# Altium schematic sheet Ind_current_sensor_U.SchDoc
size Letter
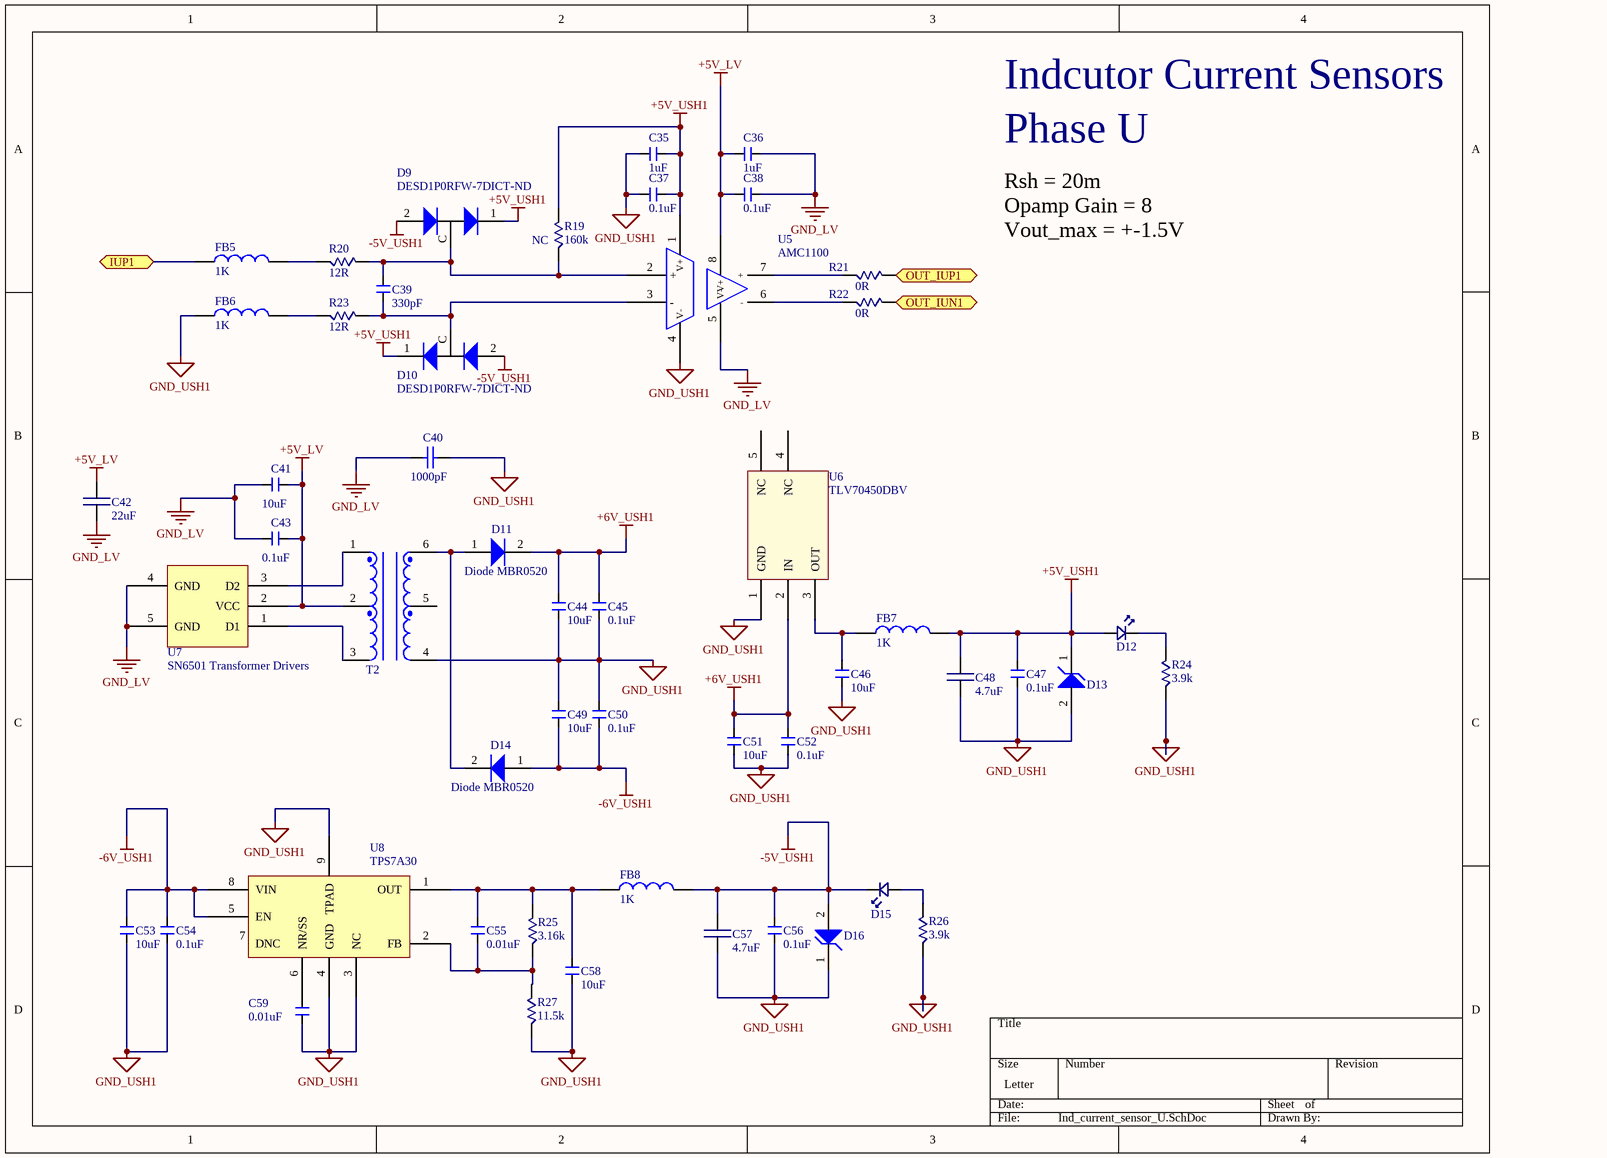
[diagram p0: Ind_current_sensor_U.SchDoc]

## Parts
C35  value 1uF  [0603 (1608 Metric)]  (hidden comment: Cap 0603_new)
C36  value 1uF  [0603 (1608 Metric)]  (hidden comment: Cap 0603_new)
C37  value 0.1uF  [0603 (1608 Metric)]  (hidden comment: Cap 0603_new)
C38  value 0.1uF  [0603 (1608 Metric)]  (hidden comment: Cap 0603_new)
C39  value 330pF  [0603 (1608 Metric)]  (hidden comment: Cap 0603_new)
C40  value 1000pF  [RAD-0.3]  (hidden comment: Cap TH)
C41  value 10uF  [0603 (1608 Metric)]  (hidden comment: Cap 0603_new)
C42  value 22uF  [0805 (2012 metric)]  (hidden comment: Cap 0805)
C43  value 0.1uF  [0603 (1608 Metric)]  (hidden comment: Cap 0603_new)
C44  value 10uF  [0603 (1608 Metric)]  (hidden comment: Cap 0603_new)
C45  value 0.1uF  [0603 (1608 Metric)]  (hidden comment: Cap 0603_new)
C46  value 10uF  [0603 (1608 Metric)]  (hidden comment: Cap 0603_new)
C47  value 0.1uF  [0603 (1608 Metric)]  (hidden comment: Cap 0603_new)
C48  value 4.7uF  [0805 (2012 metric)]  (hidden comment: Cap 0805)
C49  value 10uF  [0603 (1608 Metric)]  (hidden comment: Cap 0603_new)
C50  value 0.1uF  [0603 (1608 Metric)]  (hidden comment: Cap 0603_new)
C51  value 10uF  [0603 (1608 Metric)]  (hidden comment: Cap 0603_new)
C52  value 0.1uF  [0603 (1608 Metric)]  (hidden comment: Cap 0603_new)
C53  value 10uF  [0603 (1608 Metric)]  (hidden comment: Cap 0603_new)
C54  value 0.1uF  [0603 (1608 Metric)]  (hidden comment: Cap 0603_new)
C55  value 0.01uF  [0603 (1608 Metric)]  (hidden comment: Cap 0603_new)
C56  value 0.1uF  [0603 (1608 Metric)]  (hidden comment: Cap 0603_new)
C57  value 4.7uF  [0805 (2012 metric)]  (hidden comment: Cap 0805)
C58  value 10uF  [0603 (1608 Metric)]  (hidden comment: Cap 0603_new)
C59  value 0.01uF  [0603 (1608 Metric)]  (hidden comment: Cap 0603_new)
D9  Part: DESD1P0RFW-7DICT-ND  [SOT323_ESD]  (hidden comment: TVS - Diodes)
D10  Part: DESD1P0RFW-7DICT-ND  [SOT323_ESD]  (hidden comment: TVS - Diodes)
D11  Diode MBR0520  [SOD-123]
D12  LED  [0805 (2012 Metric) Diode]  (value not drawn)
D13  *  [POWERDI]  (value not drawn)
D14  Diode MBR0520  [SOD-123]
D15  LED  [0805 (2012 Metric) Diode]  (value not drawn)
D16  *  [POWERDI]  (value not drawn)
FB5  value 1K  [0603 (1608 Metric)]  (hidden comment: Ferrite bead)
FB6  value 1K  [0603 (1608 Metric)]  (hidden comment: Ferrite bead)
FB7  value 1K  [0603 (1608 Metric)]  (hidden comment: Ferrite bead)
FB8  value 1K  [0603 (1608 Metric)]  (hidden comment: Ferrite bead)
R19  NC  value 160k  [0603 (1608 Metric)]
R20  value 12R  [1206]  (hidden comment: Resistor 1206)
R21  value 0R  [0603 (1608 Metric)]  (hidden comment: Resistor 0603)
R22  value 0R  [0603 (1608 Metric)]  (hidden comment: Resistor 0603)
R23  value 12R  [1206]  (hidden comment: Resistor 1206)
R24  value 3.9k  [0603 (1608 Metric)]  (hidden comment: Resistor 0603)
R25  value 3.16k  [0603 (1608 Metric)]  (hidden comment: Resistor 0603)
R26  value 3.9k  [0603 (1608 Metric)]  (hidden comment: Resistor 0603)
R27  value 11.5k  [0603 (1608 Metric)]  (hidden comment: Resistor 0603)
T2  750313769  [Xmr SN6501]  (value not drawn)
U5  AMC1100  [SOIC8]
U6  TLV70450DBV  [SOT23-5]
U7  SN6501 Transformer Drivers  [SOT23-5]
U8  TPS7A30  [8-TSSOP]

## Ports
IUP1, OUT_IUN1, OUT_IUP1

## Nets
+5V_LV: C36.1(OUT) C38.1(OUT) C41.2(OUT) C42.2(OUT) C43.2(OUT) T2.2 U5.8(V+) U7.2(VCC)
+5V_USH1: C35.2(OUT) C37.2(OUT) C47.2(OUT) C48.2(OUT) D9.1(Anode) D10.1(Anode) D12.A D13.1(Anode) FB7.2(OUT) R19.2(A) U5.1(V+)
+6V_USH1: C44.2(OUT) C45.2(OUT) C51.2(OUT) C52.2(OUT) D11.2(Anode) U6.2(IN)
-5V_USH1: C56.2(OUT) C57.2(OUT) D9.2(Anode) D10.2(Anode) D15.K D16.2(Anode) FB8.2(OUT)
-6V_USH1: C49.1(OUT) C50.1(OUT) C53.2(OUT) C54.2(OUT) D14.1(Anode) U8.5(EN) U8.8(VIN)
GND_LV: C36.2(OUT) C38.2(OUT) C40.1 C41.1(OUT) C42.1(OUT) C43.1(OUT) U5.5(V-) U7.4(GND) U7.5(GND)
GND_USH1: C35.1(OUT) C37.1(OUT) C40.2 C44.1(OUT) C45.1(OUT) C46.1(OUT) C47.1(OUT) C48.1(OUT) C49.2(OUT) C50.2(OUT) C51.1(OUT) C52.1(OUT) C53.1(OUT) C54.1(OUT) C56.1(OUT) C57.1(OUT) C58.1(OUT) C59.1(OUT) D13.2(Anode) D16.1(Anode) FB6.1(OUT) R24.1(A) R26.1(A) R27.1(A) T2.4 U5.4(V-) U6.1(GND) U8.3(NC) U8.4(GND) U8.9(TPAD)
IUP1: FB5.1(OUT) ; port IUP1
OUT_IUN1: R22.2(A) ; port OUT_IUN1
OUT_IUP1: R21.2(A) ; port OUT_IUP1
NetC39_1: C39.1(OUT) D9.C(Cathode) R19.1(A) R20.2(A) U5.2(+)
NetC39_2: C39.2(OUT) D10.C(Cathode) R23.2(A) U5.3(-)
NetC46_2: C46.2(OUT) FB7.1(OUT) U6.3(OUT)
NetC55_1: C55.1(OUT) C58.2(OUT) FB8.1(OUT) R25.2(A) U8.1(OUT)
NetC55_2: C55.2(OUT) R25.1(A) R27.2(A) U8.2(FB)
NetC59_2: C59.2(OUT) U8.6(NR/SS)
NetD11_1: D11.1(Anode) D14.2(Anode) T2.6
NetD12_K: D12.K R24.2(A)
NetD15_A: D15.A R26.2(A)
NetFB5_2: FB5.2(OUT) R20.1(A)
NetFB6_2: FB6.2(OUT) R23.1(A)
NetR21_1: R21.1(A) U5.7(+)
NetR22_1: R22.1(A) U5.6(-)
NetT2_1: T2.1 U7.3(D2)
NetT2_3: T2.3 U7.1(D1)

Not connected (* = marked no-connect by the designer): T2 5(1); U6 4(NC) 5(NC); U8 7(DNC)

## Notes on the sheet
- Indcutor Current Sensors
- Phase U
- Rsh = 20m
  Opamp Gain = 8
  Vout_max = +-1.5V
  Maximum current = +- 9.375A

## Library data of the parts
C35 C36 = Cap 0603_new: CAP CER 1UF 50V X5R 0603; part: 1276-1860-1-ND
C37 C38 C43 C45 C47 C50 C52 C54 C56 = Cap 0603_new: CAP CER 0.1UF 50V Y5V 0603; part: 311-1343-6-ND
C39 = Cap 0603_new: CAP CER 330PF 50V C0G 0603; part: 445-7033-2-ND
C40 = Cap: CAP CER 1000PF 1KV Y5P RADIAL; Part: 1251PH-ND; Published: 8-Jun-2000; LatestRevisionDate: 17-Jul-2002; LatestRevisionNote: Re-released for DXP Platform.; PackageReference: RAD-0.3; Publisher: Altium Limited; PackageDescription: Radial Cap, Thru-Hole; 2 Leads; 0.3 in Pin Spacing
C41 C44 C46 C49 C51 C53 C58 = Cap 0603_new: CAP CER 10UF 35V X5R 0805; part: 490-10515-1-ND
C42 = Cap 0805: CAP CER 22UF 35V X5R 0805; Part: 445-14428-1-ND
C48 C57 = Cap 0805: CAP CER 4.7UF 50V X5R 0805; Part: 445-5980-1-ND
C55 C59 = Cap 0603_new: CAP CER 10000PF 100V X7R 0603; part: 478-7418-1-ND
D9 D10 = Diode_ESD: TVS DIODE 70VWM 8VC SOT323; Value: ESD
D11 D14 = Diode MBR0520: DIODE SCHOTTKY 20V 500MA SOD123; Part: MBR0520LT1GOSCT-ND; Value: *
D12 D15 = LED: LED 0805
D13 D16 = Diode Zener POWERDI123: Part: MMSZ5228B-FDICT-ND; Value: *
FB5-FB8 = Ferrite bead: FERRITE BEAD 1 KOHM 0603 1LN; Part: 445-8672-1-ND
R19 = Resistor 0603
R20 R23 = Resistor 1206: 12 Ohm ±0.5% 0.25W, 1/4W Chip Resistor 1206; Part: 311-2961-1-ND
R21 R22 = Resistor 0603: RES SMD 10 OHM 0.05% 1/10W 0603; Part: RNCF0603AKT10R0CT-ND
R24 R26 = Resistor 0603: RES SMD 3.9K OHM 5% 1/10W 0603; Part: 541-3.9KGCT-ND
R25 = Resistor 0603: RES SMD 3.16K OHM 1% 1/10W 0603; Part: 311-3.16KHRCT-ND
R27 = Resistor 0603: RES SMD 11.5K OHM 1% 1/10W 0603; Part: 541-11.5KHCT-ND
T2 = 750313769: TRANSFORMER SMD TR1.7 SN6501; Part: 1297-1107-1-ND
U5 = AMC1100: IC OPAMP ISOLATION 100KHZ 8SOIC; Part: 296-38822-5-ND
U6 = TLV70450DBV: IC REG LDO 5V 0.15A SOT23-5; Part: 296-39287-1-ND
U7 = SN6501: IC REG CONV PWR SUPPLIES SOT23-5; Part: 296-37700-1-ND; Value: *
U8 = TPS7A30: IC REG LDO NEG ADJ 0.2A 8MSOP; Part: 296-27750-1-ND